# Altium schematic sheet Pico SCSI v1_Sch_Altium.schdoc
size 275 x 185 mm
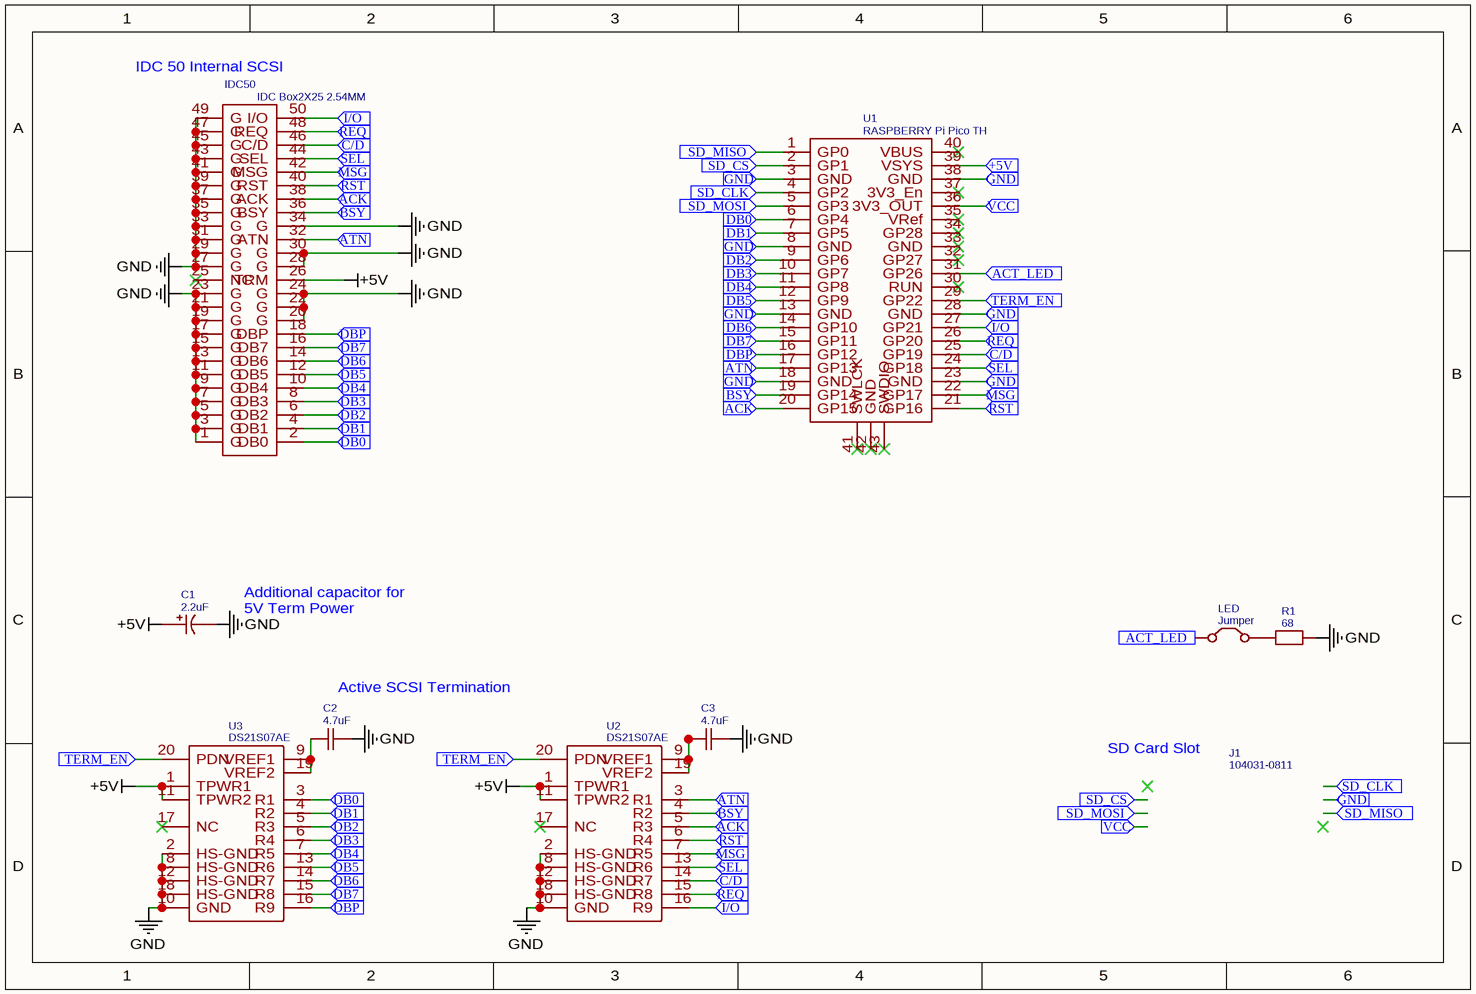
[diagram p0: Pico SCSI v1_Sch_Altium.schdoc]

## Parts
C1  2.2uF  [CAP-SMD_L3.2-W1.6]
C2  4.7uF  [C0603]
C3  4.7uF  [C0603]
IDC50  IDC Box2X25 2.54MM  [IDC-TH_50P-P2.54_BOOMELE2X25P]
J1  104031-0811  [1040310811]
LED  Jumper  [SIP2]
R1  68  [R1206]
U1  RASPBERRY Pi Pico TH  [RASPBERRY PI PICO]
U2  DS21S07AE  [TSSOP20]
U3  DS21S07AE  [TSSOP20]

## Ports
+5V (in), ACK (in), ACT_LED (in), ATN (in), BSY (in), C/D (in), DB0 (in), DB1 (in), DB2 (in), DB3 (in), DB4 (in), DB5 (in), DB6 (in), DB7 (in), DBP (in), GND (in), I/O (in), MSG (in), REQ (in), RST (in), SD_CLK (in), SD_CS (in), SD_MISO (in), SD_MOSI (in), SEL (in), TERM_EN (in), VCC (in)

## Nets
+5V: C1.1 IDC50.26(TRM) U2.1(TPWR1) U2.11(TPWR2) U3.1(TPWR1) U3.11(TPWR2)
GND: C1.2 C2.2 C3.2 IDC50.1(G) IDC50.3(G) IDC50.5(G) IDC50.7(G) IDC50.9(G) IDC50.11(G) IDC50.13(G) IDC50.15(G) IDC50.17(G) IDC50.19(G) IDC50.20(G) IDC50.21(G) IDC50.22(G) IDC50.23(G) IDC50.24(G) IDC50.27(G) IDC50.28(G) IDC50.29(G) IDC50.30(G) IDC50.31(G) IDC50.33(G) IDC50.34(G) IDC50.35(G) IDC50.37(G) IDC50.39(G) IDC50.41(G) IDC50.43(G) IDC50.45(G) IDC50.47(G) IDC50.49(G) R1.2 U2.2(HS-GND) U2.8(HS-GND) U2.10(GND) U2.12(HS-GND) U2.18(HS-GND) U3.2(HS-GND) U3.8(HS-GND) U3.10(GND) U3.12(HS-GND) U3.18(HS-GND)
+5V: U1.39(VSYS) ; port +5V  [a separate net that carries the same name]
ACK: IDC50.38(ACK) U1.20(GP15) U2.5(R3) ; port ACK
ACT_LED: LED.2(C2) U1.31(GP26) ; port ACT_LED
ATN: IDC50.32(ATN) U1.17(GP13) U2.3(R1) ; port ATN
BSY: IDC50.36(BSY) U1.19(GP14) U2.4(R2) ; port BSY
C/D: IDC50.46(C/D) U1.25(GP19) U2.14(R7) ; port C/D
DB0: IDC50.2(DB0) U1.6(GP4) U3.3(R1) ; port DB0
DB1: IDC50.4(DB1) U1.7(GP5) U3.4(R2) ; port DB1
DB2: IDC50.6(DB2) U1.9(GP6) U3.5(R3) ; port DB2
DB3: IDC50.8(DB3) U1.10(GP7) U3.6(R4) ; port DB3
DB4: IDC50.10(DB4) U1.11(GP8) U3.7(R5) ; port DB4
DB5: IDC50.12(DB5) U1.12(GP9) U3.13(R6) ; port DB5
DB6: IDC50.14(DB6) U1.14(GP10) U3.14(R7) ; port DB6
DB7: IDC50.16(DB7) U1.15(GP11) U3.15(R8) ; port DB7
DBP: IDC50.18(DBP) U1.16(GP12) U3.16(R9) ; port DBP
GND: U1.3(GND) U1.8(GND) U1.13(GND) U1.18(GND) U1.23(GND) U1.28(GND) U1.38(GND) ; port GND  [a separate net that carries the same name]
I/O: IDC50.50(I/O) U1.27(GP21) U2.16(R9) ; port I/O
MSG: IDC50.42(MSG) U1.22(GP17) U2.7(R5) ; port MSG
REQ: IDC50.48(REQ) U1.26(GP20) U2.15(R8) ; port REQ
RST: IDC50.40(RST) U1.21(GP16) U2.6(R4) ; port RST
SD_CLK: U1.4(GP2) ; port SD_CLK
SD_CS: U1.2(GP1) ; port SD_CS
SD_MISO: U1.1(GP0) ; port SD_MISO
SD_MOSI: U1.5(GP3) ; port SD_MOSI
SEL: IDC50.44(SEL) U1.24(GP18) U2.13(R6) ; port SEL
TERM_EN: U1.29(GP22) U2.20(PDN) U3.20(PDN) ; port TERM_EN
VCC: U1.36(3V3_OUT) ; port VCC
NetC2_1: C2.1 U3.9(VREF1) U3.19(VREF2)
NetC3_1: C3.1 U2.9(VREF1) U2.19(VREF2)
NetLED_1: LED.1(C1) R1.1

Not connected (* = marked no-connect by the designer): IDC50 25(NC)*; U1 30(RUN)* 32(GP27)* 33(GND)* 34(GP28)* 35(VRef)* 37(3V3_En)* 40(VBUS)* 41(SWLCK)* 42(GND)* 43(SWDIO)*; U2 17(NC)*; U3 17(NC)*

## Notes on the sheet
- (near IDC50) IDC 50 Internal SCSI
- (near C2) Additional capacitor for
  5V Term Power
- (near C2) Active SCSI Termination
- SD Card Slot

## Library data of the parts
C1 = 2.2uF: BOM_Manufacturer: CEC(Shenzhen Zhenhua XinYun Elec); BOM_Manufacturer Part: CA45-A-16V-2.2uF-M; nameAlias: Capacitance; Contributor: LCSC; BOM_Supplier: LCSC; BOM_Supplier Part: C688947; spicePre: C; spiceSymbolName: CA45-A-16V-2.2UF-M
C2 C3 = 4.7uF: BOM_Manufacturer Part: CL10A475KP8NNNC; BOM_Manufacturer: SAMSUNG; nameAlias: Capacitance; SMT Type: Extend; BOM_Supplier: LCSC; BOM_Supplier Part: C1705; BOM_JLCPCB SMD: Yes; BOM_LCSC Assembly: Yes; spicePre: C; spiceSymbolName: CL10A475KP8NNNC
IDC50 = IDC Box2X25 2.54MM: BOM_Manufacturer: BOOMELE; SMT Type: Extend; BOM_Supplier: LCSC; BOM_Manufacturer Part: IDC Box2X25 2.54MM; image: //image.lceda.cn/szlcsc/C30006.jpg; BOM_Supplier Part: C30006; BOM_LCSC Assembly: Yes; spicePre: P; spiceSymbolName: IDC Box2X25 2.54MM
J1 = 104031-0811: Contributor: Lloyd Cargo; spicePre: J; spiceSymbolName: 104031-0811
LED = Jumper: Contributor: Parinya Soontook; spicePre: J; spiceSymbolName: Jumper
R1 = 68: BOM_Manufacturer: UNI-ROYAL(Uniroyal Elec); BOM_Manufacturer Part: TC0650F680JT5E; nameAlias: Resistance (Ohms); Contributor: LCSC; SMT Type: Extend; BOM_Supplier: LCSC; BOM_Supplier Part: C411538; BOM_JLCPCB SMD: Yes; BOM_LCSC Assembly: Yes; spicePre: R; spiceSymbolName: TC0650F680JT5E
U1 = RASPBERRY Pi Pico TH: Contributor: untung91; spicePre: U; spiceSymbolName: RASPBERRY Pi Pico TH
U2 U3 = DS21S07AE: description: SCSI Terminator; spicePre: U; spiceSymbolName: DS21S07AE